# Altium schematic sheet TCAN1146_PINOUT.SchDoc
size B; SheetNumber: 15; SheetTotal: 21
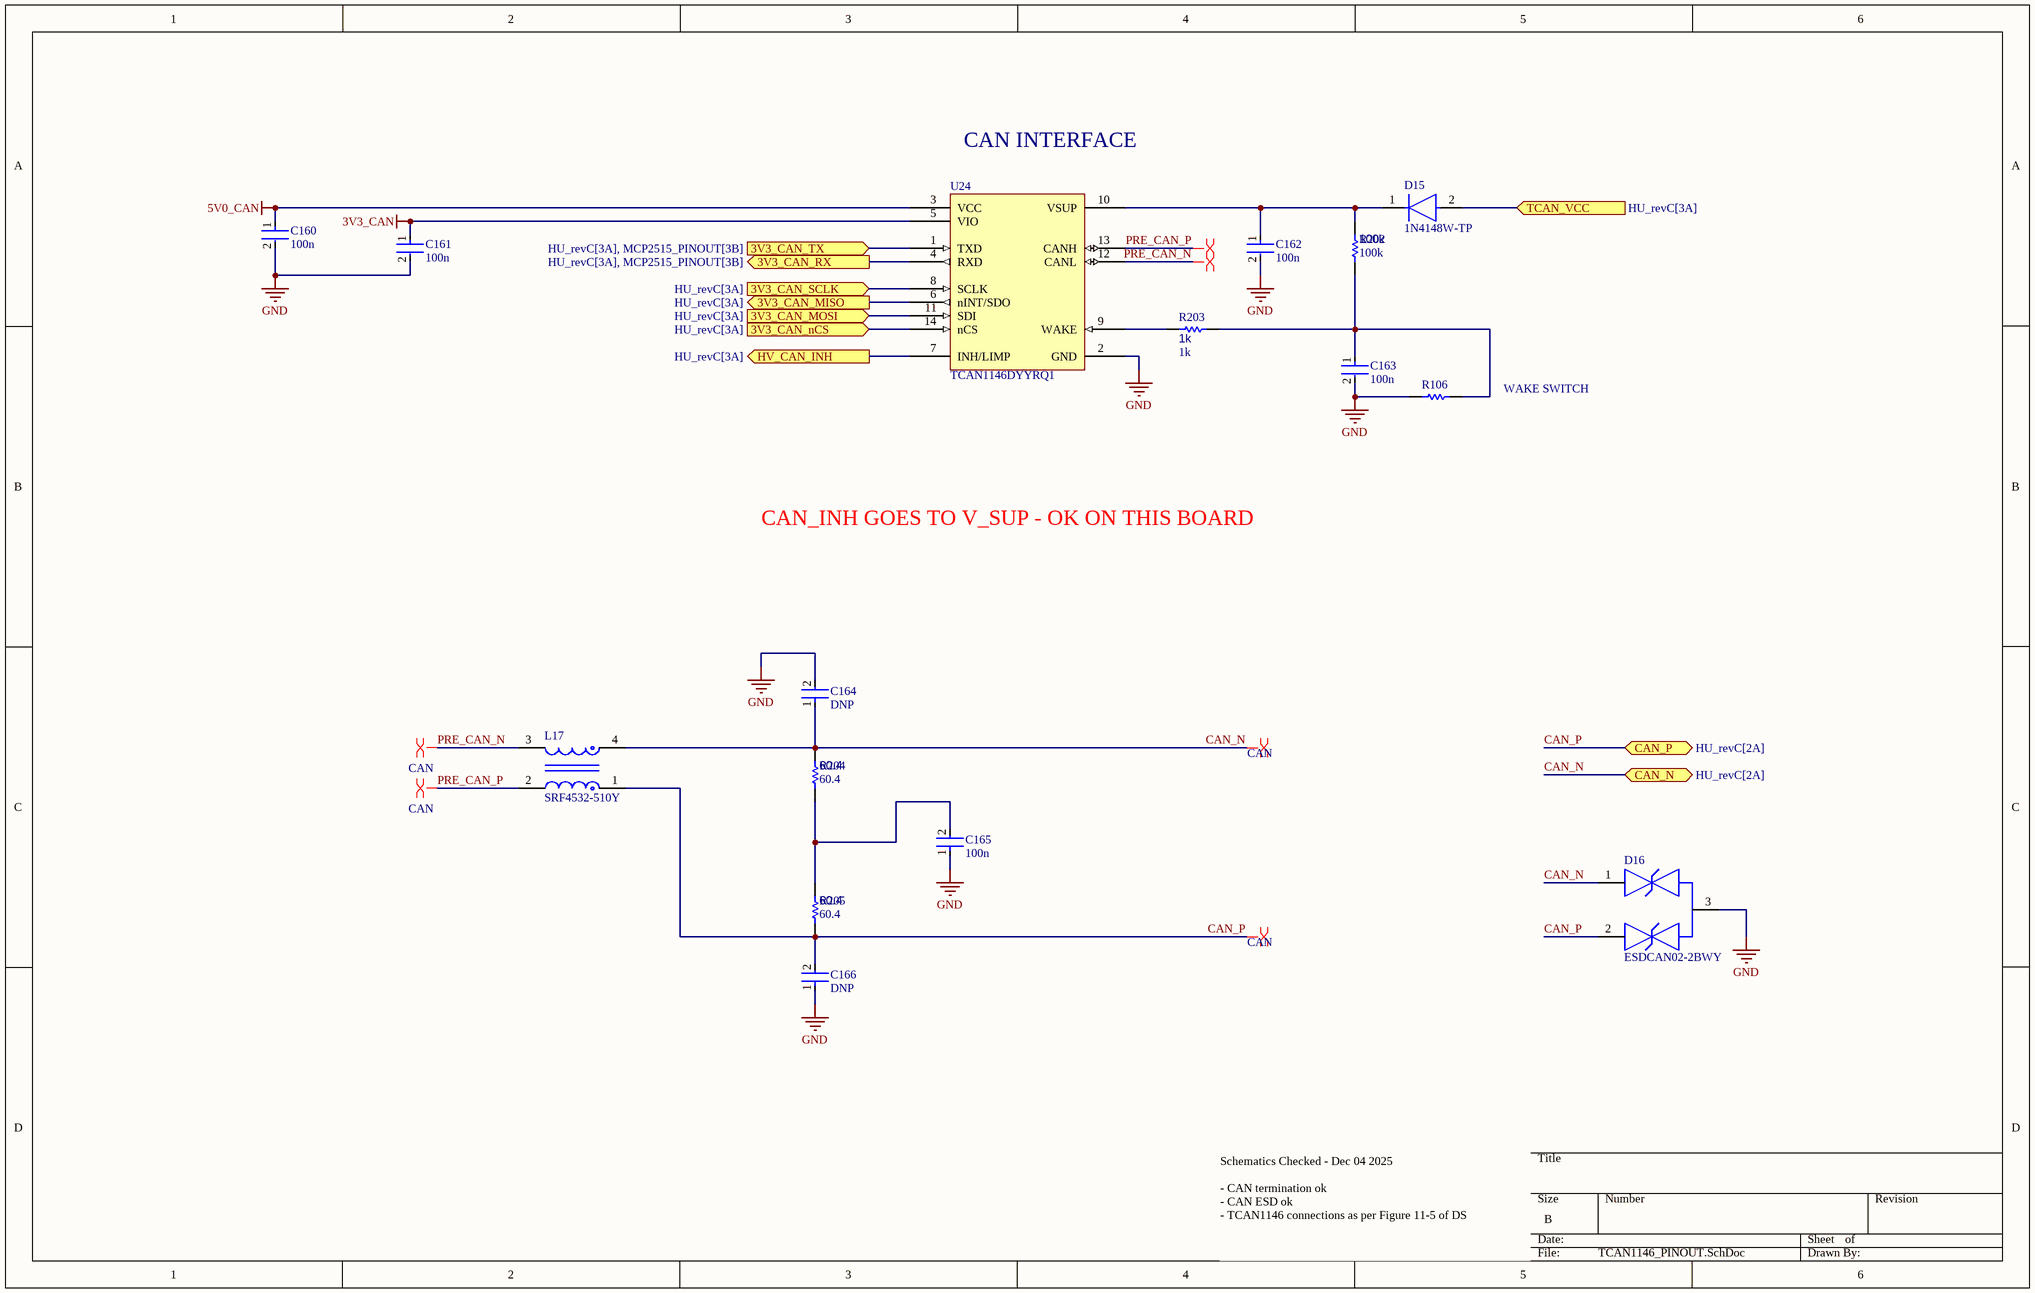
[diagram p0: TCAN1146_PINOUT.SchDoc]

## Parts
C160  100n  [FP-0402-L_1_0_0_05-W_0_5-IPC_A]
C161  100n  [FP-0402-L_1_0_0_05-W_0_5-IPC_A]
C162  100n  [FP-0402-L_1_0_0_05-W_0_5-IPC_A]
C163  100n  [FP-0402-L_1_0_0_05-W_0_5-IPC_A]
C164  DNP  [FP-0402-L_1_0_0_05-W_0_5-IPC_A]
C165  100n  [FP-0402-L_1_0_0_05-W_0_5-IPC_A]
C166  DNP  [FP-0402-L_1_0_0_05-W_0_5-IPC_A]
D15  1N4148W-TP  [FP-SOD-123-IPC_A]
D16  ESDCAN02-2BWY  [FP-SOT323-3L-MFG]
L17  SRF4532-510Y  [FP-SRF4532-MFG]
R106  0402 JUMPER  [RESC1005X40X25ML05T05]  (value not drawn)
R202  100k  [R0603B]
R203  1k  [R0603B]
R204  60.4  [R0603B]
R205  60.4  [R0603B]
U24  TCAN1146DYYRQ1  [TCAN1146DYYRQ1-Footprint-1]

## Ports
3V3_CAN_MISO (out, see HU_revC[3A]), 3V3_CAN_MOSI (in, see HU_revC[3A]), 3V3_CAN_nCS (in, see HU_revC[3A]), 3V3_CAN_RX (out, see HU_revC[3A], MCP2515_PINOUT[3B]), 3V3_CAN_SCLK (in, see HU_revC[3A]), 3V3_CAN_TX (in, see HU_revC[3A], MCP2515_PINOUT[3B]), CAN_N (bidir, see HU_revC[2A]), CAN_P (bidir, see HU_revC[2A]), HV_CAN_INH (out, see HU_revC[3A]), TCAN_VCC (in, see HU_revC[3A])

## Nets
3V3_CAN: C161.1 U24.5(VIO)
5V0_CAN: C160.1 U24.3(VCC)
GND: C160.2 C161.2 C162.2 C163.2 C164.2 C165.1 C166.1 D16.3 R106.1 U24.2(GND)
3V3_CAN_MISO: U24.6(nINT/SDO) ; port 3V3_CAN_MISO
3V3_CAN_MOSI: U24.11(SDI) ; port 3V3_CAN_MOSI
3V3_CAN_nCS: U24.14(nCS) ; port 3V3_CAN_nCS
3V3_CAN_RX: U24.4(RXD) ; port 3V3_CAN_RX
3V3_CAN_SCLK: U24.8(SCLK) ; port 3V3_CAN_SCLK
3V3_CAN_TX: U24.1(TXD) ; port 3V3_CAN_TX
CAN_N: C164.1 D16.1 L17.4 R204.2 ; port CAN_N
CAN_P: C166.2 D16.2 L17.1 R205.1 ; port CAN_P
HV_CAN_INH: U24.7(INH/LIMP) ; port HV_CAN_INH
PRE_CAN_N: L17.3 U24.12(CANL)
PRE_CAN_P: L17.2 U24.13(CANH)
TCAN_VCC: D15.2(A) ; port TCAN_VCC
NetC162_1: C162.1 D15.1(C) R202.2 U24.10(VSUP)
NetC163_1: C163.1 R106.2 R202.1 R203.2
NetC165_2: C165.2 R204.1 R205.2
NetR203_1: R203.1 U24.9(WAKE)

## Layout directives
differential pair: PRE_CAN_N, PRE_CAN_P
differential pair; differential pair class CAN: CAN_N, CAN_P, PRE_CAN_N, PRE_CAN_P

## Notes on the sheet
- CAN INTERFACE
- WAKE SWITCH
- CAN_INH GOES TO V_SUP - OK ON THIS BOARD
- Schematics Checked - Dec 04 2025
  - CAN termination ok
  - CAN ESD ok
  - TCAN1146 connections as per Figure 11-5 of DS

## Library data of the parts
C160-C166 = CMP-001-00058-1: LARGE PADS, 0402 CAP, CHANGE COMMENT TO MATCH REAL P/N; Capacitor Type: Ceramic; Min Operating Temperature: -55°C; Mounting Technology: Surface Mount; Pins: 2; Case/Package: 0402; RoHS Compliant: Yes; Max Operating Temperature: 85°C
D15 = CMP-2000-04993-2: DIODE GEN PURP 100V 150MA SOD123; Max Reverse Leakage Current: 5uA; Max Surge Current: 2A; Reverse Recovery Time: 4ns; Polarity: Standard; Capacitance: 4pF; Max Forward Surge Current (Ifsm): 1A; Element Configuration: Single; Power Dissipation: 400mW; Forward Voltage: 1V; Radiation Hardening: No; Lead Free: Lead Free; Max Reverse Voltage (DC): 100V; Current Rating: 150mA; Forward Current: 150mA; Packaging: Tape and Reel; Number of Pins: 2; Package Quantity: 3000; Max Operating Temperature: 150°C; Min Operating Temperature: -65°C; Average Rectified Current: 150mA; Recovery Time: 4ns; Output Current: 150mA; Peak Non-Repetitive Surge Current: 2A; Width: 1.8mm; Voltage Rating (DC): 100V; Height: 1.2mm; Max Repetitive Reverse Voltage (Vrrm): 100V; Mount: Surface Mount; Length: 2.85mm
D16 = CMP-12225-000055-1: TVS DIODE 26.5V 44V SOT323-3; Manufacturer: STMicroelectronics; Value: 3pF; Direction: Bidirectional; Breakdown Voltage: 28.5V; Automotive Grade: Grade 0; Standoff Height: 0mm; Peak Pulse Power: 170W; Peak Pulse Current: 3A; Number Of Channels: 2; Max Junction Temp: +175°C; Mouser Description: TVS Diodes / ESD Suppressors Automotive dual-line Transil, Transient voltage suppressor (TVS) for CAN bus; Height: 1.1mm; Category: Diode; Reverse Standoff Voltage: 26.5V; Device Class L1: Circuit Protection; Temperature: -55°C to +175°C; RoHS: TRUE; ComponentLink2URL: https://www.st.com/resource/en/datasheet/esdcan02-2bwy.pdf; Device Class L3: unset; Device Class L2: TVS Diodes; Temperature Range High: +175°C; Octopart: https://octopart.com/esdcan02-2bwy-stmicroelectronics-58631133; Ipc Land Pattern Name: SOT65P210X95-3; Temperature Range Low: -55°C; Capacitance: 3pF; Digikey Description: TVS DIODE 26.5V 44V SOT323-3; Automotive: Yes; ComponentLink2Description: Datasheet; Clamping Voltage: 44V; Manufacturer Part Number: ESDCAN02-2BWY; Lead Free: Yes; Package: SOT323-3L
L17 = CMP-07251-000006-1: CMC 51UH 200MA 2LN 2KOHM SMD; Element Configuration: Dual; Number of Lines: 2; Core Material: Ferrite; Impedance: 2kR; Test Frequency: 100kHz; Voltage Rating (DC): 50V; Insulation Resistance: 10MR; Material: Steel; Tolerance: 50%; DC Resistance (DCR): 3.5R; RoHS Compliant: Yes; Mount: Surface Mount; REACH SVHC: No SVHC; Termination: SMD/SMT; DC Current: 200mA; Current: 200mA; Lead Free: Lead Free; Contact Plating: Tin; Length: 4.5mm; Max DC Current: 200mA; Width: 0.126inch; Case/Package: 4532; Packaging: Tape and Reel; Package Quantity: 1; Min Operating Temperature: -40°C; Depth: 3.4mm; Series: SRF4532; Max Operating Temperature: 125°C; Current Rating: 200mA; Self Resonant Frequency: 100kHz; Height: 0.118inch; Inductance: 51uH; Resistance: 2kR
R106 = CMP-009-00118-2: READ THE NAME; Pins: 2; Component Type: Standard; Design Item ID: CMP-009-00206-2; Source: 0402jump.SchLib
R202-R205 = CMP-009-00002-14: Resistor
  R202: Value: 100k
  R203: Value: 1k
  R204 R205: Value: 60.4
U24 = CMP-318-000000-2: Automotive CAN FD transceiver with watchdog, bus diagnostics and partial networking via sele 14-SOT-23-THIN -40 to 150; Component Type: Standard; Design Item ID: CMP-015-00012-2; Pin Count: 14; Source: TCAN1146DYYRQ1.SchLib